# EAGLE design euglena (EAGLE 7.4.0)
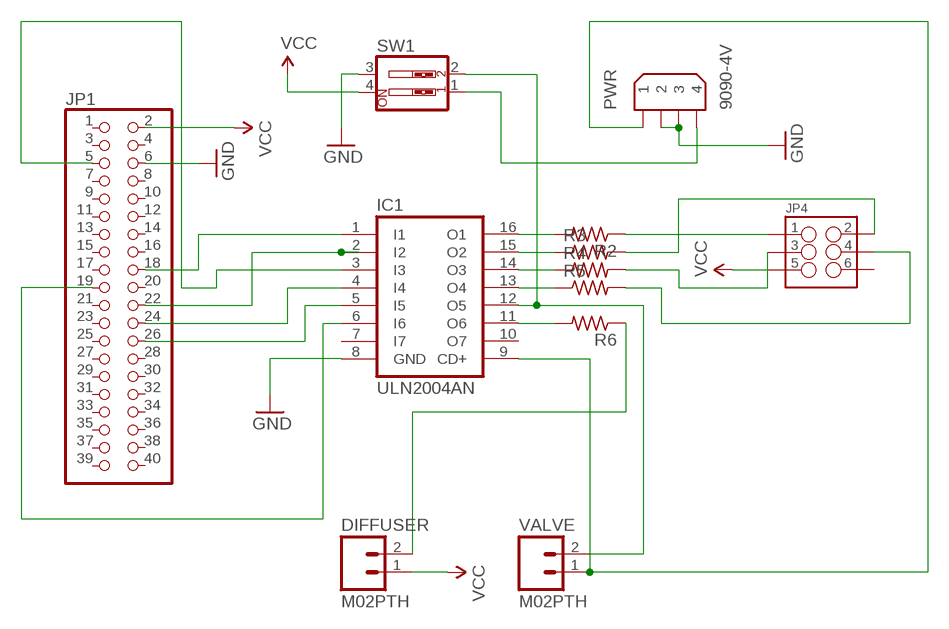
[diagram p0: schematic, sheet 1]

## Parts
DIFFUSER  M02PTH  [1X02]
IC1  ULN2004AN  [DIL16]
JP1  PINHD-2X20  [2X20]
JP4  M03X2NO_SILK  [2X3-NS]
PWR  9090-4V  [9090-4V]
R2  R-US_0204/5  [0204/5]
R3  R-US_0204/5  [0204/5]
R4  R-US_0204/5  [0204/5]
R5  R-US_0204/5  [0204/5]
R6  R-US_0204/5  [0204/5]
SW1  SW_DIP-2  [DIPSWITCH-02]
VALVE  M02PTH  [1X02]

## Nets
5V: PWR.4 SW1.1
12V: IC1.9(CD+) PWR.1 VALVE.1
GND: IC1.8(GND) JP1.6 PWR.2 PWR.3 SW1.3
N$1: IC1.16(O1) R2.2
N$2: IC1.2(I2) JP1.22
N$3: IC1.15(O2) R3.1
N$4: IC1.14(O3) R4.1
N$5: IC1.13(O4) R5.1
N$6: JP4.4 R5.2
N$8: JP4.1 R2.1
N$9: JP4.2 R3.2
N$10: JP4.3 R4.2
N$13: IC1.11(O6) R6.2
N$14: IC1.4(I4) JP1.24
N$18: IC1.1(I1) JP1.18
N$19: IC1.5(I5) JP1.26
N$20: IC1.3(I3) JP1.5
N$21: DIFFUSER.2 R6.1
N$22: IC1.12(O5) SW1.2 VALVE.2
N$23: IC1.6(I6) JP1.19
VCC: DIFFUSER.1 JP1.2 JP4.5 SW1.4
Unconnected: IC1.7(I7) IC1.10(O7) JP1.1 JP1.3 JP1.4 JP1.7 JP1.8 JP1.9 JP1.10 JP1.11 JP1.12 JP1.13 JP1.14 JP1.15 JP1.16 JP1.17 JP1.20 JP1.21 JP1.23 JP1.25 JP1.27 JP1.28 JP1.29 JP1.30 JP1.31 JP1.32 JP1.33 JP1.34 JP1.35 JP1.36 JP1.37 JP1.38 JP1.39 JP1.40 JP4.6

## Library data of the parts
DIFFUSER VALVE = SparkFun-Connectors:M02: Standard 2-pin 0.1" header. Use with - straight break away headers ( PRT-00116) - right angle break away headers (PRT-00553) - swiss pins (PRT-00743) - machine pins (PRT-00117) - female headers (PRT-00115) Molex polarized connector foot print use with: PRT-08233 with associated crimp pins and housings. 2.54_SCREWTERM for use with PRT-10571. 3.5mm Screw Terminal footprints for PRT-08084 5mm Screw Terminal footprints for use with PRT-08433
IC1 = uln-udn:ULN2004A: DRIVER ARRAY
JP1 = pinhead:PINHD-2X20: PIN HEADER
JP4 = SparkFun-Connectors:M03X2: 2x3 .1" header. Shrouded, with keying- CONN-10681 SMT- CONN-11415 Pogo pins- HW-11044
PWR = con-thomas-betts:9090-4: Disk Drive Power four position Source: Thomas & Betts Electronic Interconnects Eiropean Edition 1998; OC_FARNELL: unknown; OC_NEWARK: unknown
R2-R6 = resistor:R-US_: RESISTOR, American symbol
SW1 = SparkFun-Electromechanical:SW_DIP-2: DIP SWITCH

## Net classes
0 default: clearance 0.205 mm

## Board
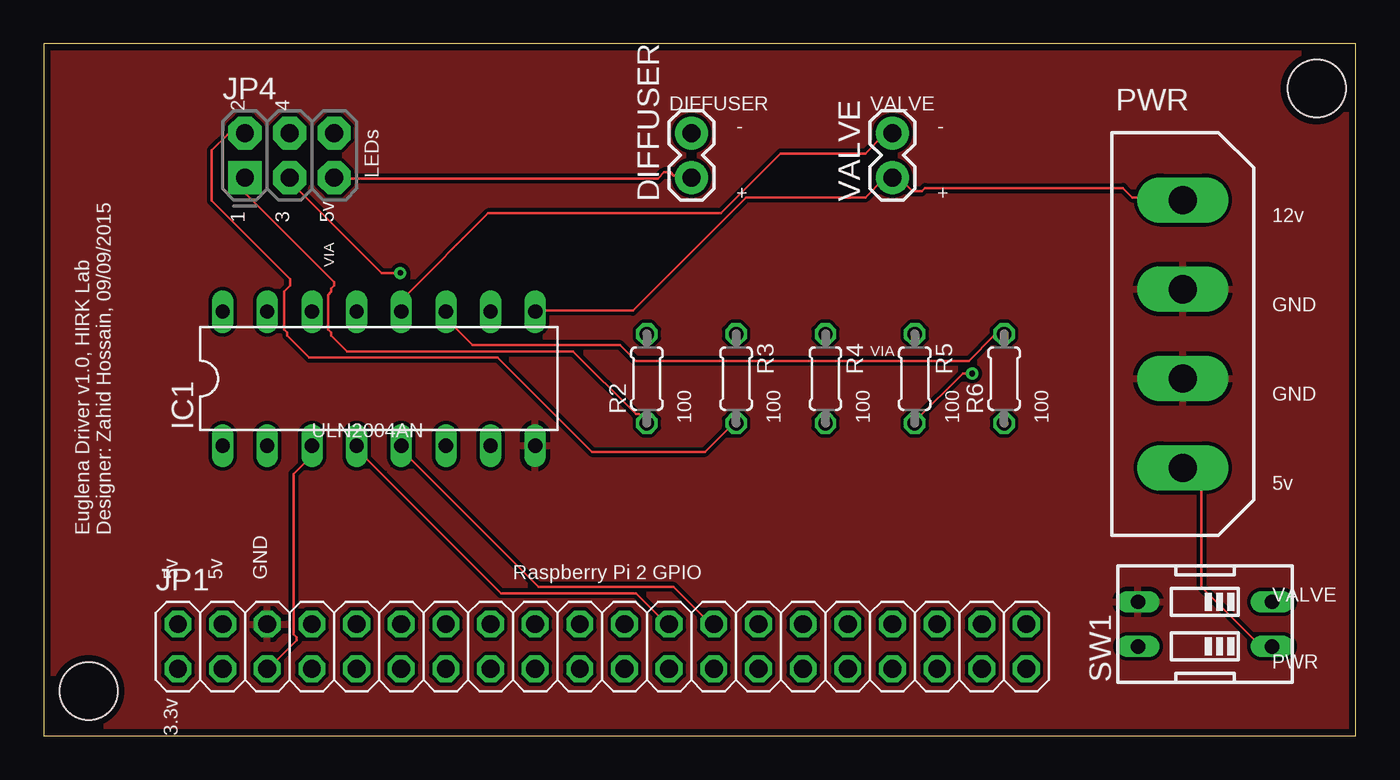
[diagram p1: board, top side]
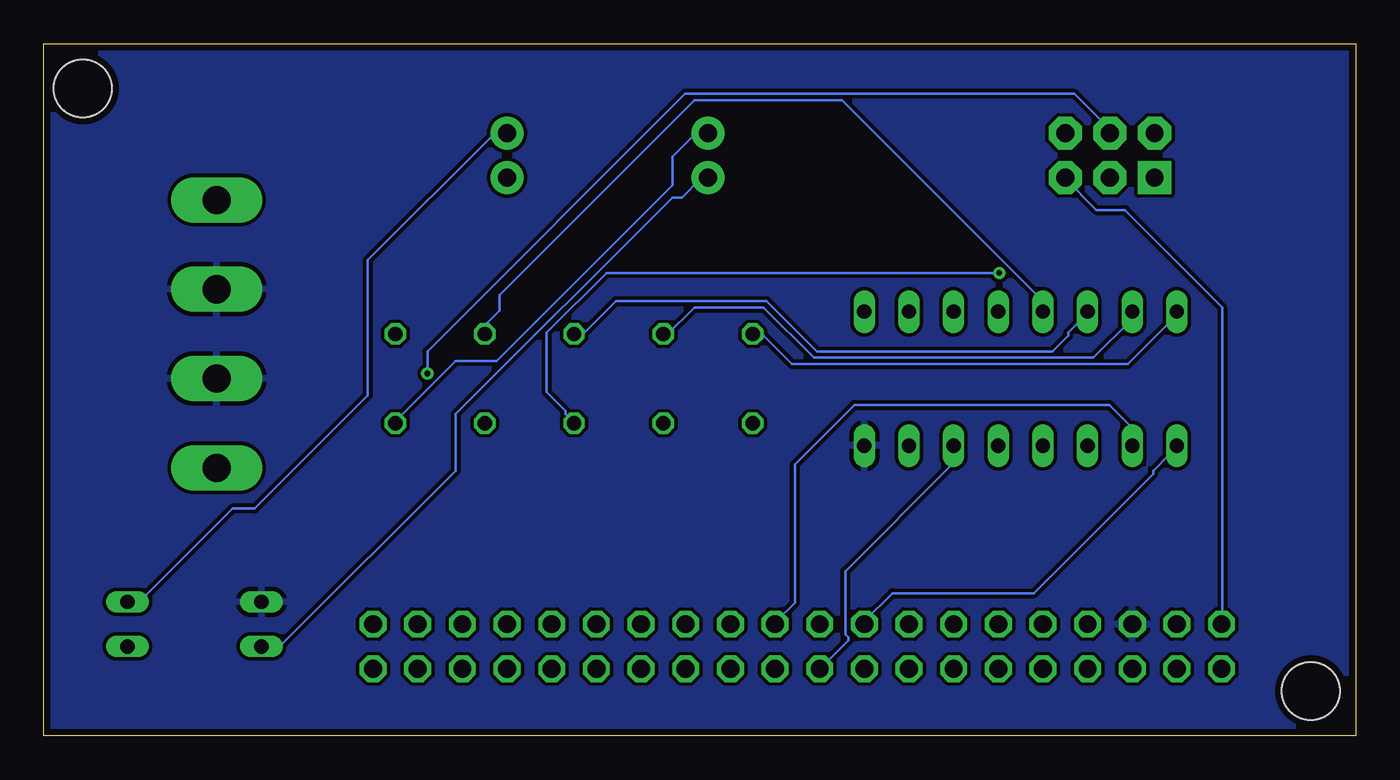
[diagram p2: board, bottom side, seen from below]

Size 74.6 x 39.36 mm. Coordinates in mm from the lower left corner, seen from the top.
Outline: 0,0 74.6,0 74.6,39.36 0,39.36 0,0
Copper layers (1*16): Top 0.0356mm / dielectric 1.5011mm / Bottom 0.0356mm
Design rules "LaenPCBOrder": minimum track width 6mil, minimum drill 13mil, track to track 6mil, track to pad 6mil, pad to pad 6mil, via to via 6mil, smd to smd 6mil, copper to edge 15mil, drill to drill 6mil, minimum pad ring 7mil, minimum via ring 7mil, stop-mask expansion 3mil, vias tented up to drill 0mil, thermal gap 10mil

### Footprints (pad centres in the part's own frame; a part is rotated, then mirrored left to right if it is on the bottom)
1X02 = drill 1.016 pad 1.88: 1 0,0; 2 2.54,0
STAND-OFF = hole 3.302: 0,0
DIL16 = drill 0.813 long: 1 -8.89,-3.81; 2 -6.35,-3.81; 3 -3.81,-3.81; 4 -1.27,-3.81; 5 1.27,-3.81; 6 3.81,-3.81; 7 6.35,-3.81; 8 8.89,-3.81; 9 8.89,3.81; 10 6.35,3.81; 11 3.81,3.81; 12 1.27,3.81; 13 -1.27,3.81; 14 -3.81,3.81; 15 -6.35,3.81; 16 -8.89,3.81
2X20 = drill 1.016 octagon: 1 -24.13,-1.27; 2 -24.13,1.27; 3 -21.59,-1.27; 4 -21.59,1.27; 5 -19.05,-1.27; 6 -19.05,1.27; 7 -16.51,-1.27; 8 -16.51,1.27; 9 -13.97,-1.27; 10 -13.97,1.27; 11 -11.43,-1.27; 12 -11.43,1.27; 13 -8.89,-1.27; 14 -8.89,1.27; 15 -6.35,-1.27; 16 -6.35,1.27; 17 -3.81,-1.27; 18 -3.81,1.27; 19 -1.27,-1.27; 20 -1.27,1.27; 21 1.27,-1.27; 22 1.27,1.27; 23 3.81,-1.27; 24 3.81,1.27; 25 6.35,-1.27; 26 6.35,1.27; 27 8.89,-1.27; 28 8.89,1.27; 29 11.43,-1.27; 30 11.43,1.27; 31 13.97,-1.27; 32 13.97,1.27; 33 16.51,-1.27; 34 16.51,1.27; 35 19.05,-1.27; 36 19.05,1.27; 37 21.59,-1.27; 38 21.59,1.27; 39 24.13,-1.27; 40 24.13,1.27
2X3-NS = drill 1.016 pad 1.88 square: 1 -2.54,-1.27 | drill 1.016 pad 1.88 octagon: 2 -2.54,1.27; 3 0,-1.27; 4 0,1.27; 5 2.54,-1.27; 6 2.54,1.27
9090-4V = drill 1.6 pad 2.6 long: 1 -7.62,0; 2 -2.54,0; 3 2.54,0; 4 7.62,0
0204/5 = drill 0.813 octagon: 1 -2.54,0; 2 2.54,0
DIPSWITCH-02 = drill 0.813 long: 1 -1.27,-3.81; 2 1.27,-3.81; 3 1.27,3.81; 4 -1.27,3.81

### Placement (x,y rotation side)
DIFFUSER  36.83,31.75 90 top
E$1  [STAND-OFF]  72.39,36.83 0 top
E$2  [STAND-OFF]  2.54,2.54 0 top
IC1  19.05,20.32 0 top
JP1  31.75,5.08 0 top
JP4  13.97,33.02 0 top
PWR  64.77,22.86 270 top
R2  34.29,20.32 90 top
R3  39.37,20.32 270 top
R4  44.45,20.32 270 top
R5  49.53,20.32 270 top
R6  54.61,20.32 90 top
SW1  66.04,6.35 90 top
VALVE  48.26,31.75 90 top

### Tracks (layer width: path | path; a pad name or v marks a point on that pad's centre or on a via)
5V
  Top 0.152: SW1.1 69.77,5.25 69.06,5.25 65.84,8.46 65.84,14.18 64.94,15.08 PWR.4
12V
  Top 0.152: IC1.9 27.95,24.19 33.49,24.19 39.93,30.62 46.72,30.62 47.79,31.7 48.15,31.7 VALVE.1 48.32,31.7 48.68,31.7 49.4,30.98 49.93,30.98 50.11,31.16 61.37,31.16 61.91,30.62 64.77,30.62 PWR.1
GND
  pour Top: 0,39.37 0,0 74.93,0 74.93,39.37
  pour Bottom: -1.27,40.64 -1.27,-1.27 76.2,-1.27 76.2,40.64
N$1
  Bottom 0.152: IC1.16 10.26,24.01 10.62,23.65 10.62,23.48 12.94,21.15 32.06,21.15 33.67,22.76 34.21,22.76 R2.2
N$2
  Bottom 0.152: IC1.2 12.76,16.68 12.76,17.58 14.02,18.83 28.49,18.83 31.88,15.43 31.88,7.57 32.96,6.5 JP1.22
N$3
  Bottom 0.152: IC1.15 12.76,24.01 12.76,23.65 14.91,21.51 30.81,21.51 33.67,24.37 37.6,24.37 39.21,22.76 R3.1
N$4
  Bottom 0.152: IC1.14 15.27,24.01 16.34,22.94 16.34,22.76 17.23,21.87 30.63,21.87 33.49,24.73 42.07,24.73 43.86,22.94 44.39,22.94 R4.1
N$5
  Bottom 0.152: IC1.13 17.95,24.19 17.95,24.9 29.2,36.16 37.6,36.16 48.68,25.08 48.68,24.19 49.4,23.48 49.4,22.94 R5.1
N$6  (via drill 0.33)
  Top 0.152: v52.79,20.62 52.26,20.62 49.58,17.94 R5.2
  Bottom 0.152: v52.79,20.62 52.79,21.87 38.14,36.52 15.98,36.52 13.84,34.38 JP4.4
N$8
  Top 0.152: R2.1 34.21,17.94 33.85,18.29 33.67,18.29 30.1,21.87 17.23,21.87 16.34,22.76 16.34,22.94 16.16,23.12 16.16,25.08 16.34,25.26 16.34,25.44 16.52,25.62 16.52,25.8 11.51,30.8 11.51,31.7 JP4.1
N$9
  Top 0.152: R3.2 39.21,17.76 37.6,16.15 31.17,16.15 25.81,21.51 15.09,21.51 13.84,22.76 13.84,22.94 13.66,23.12 13.66,25.26 14.02,25.62 14.02,25.98 9.55,30.44 9.55,33.3 10.44,34.2 11.34,34.2 JP4.2
N$10  (via drill 0.33)
  Top 0.152: v20.27,26.33 19.2,26.33 13.84,31.7 JP4.3
  Bottom 0.152: v20.27,26.33 42.61,26.33 46,22.94 46,19.54 44.93,18.47 44.93,18.29 44.57,17.94 R4.2
N$13
  Top 0.152: IC1.11 22.95,24.01 22.95,23.65 24.38,22.22 32.78,22.22 33.67,21.33 52.61,21.33 54.04,22.76 54.58,22.76 R6.2
N$14
  Top 0.152: IC1.4 17.95,16.51 17.95,16.15 25.99,8.11 33.67,8.11 35.46,6.32 JP1.24
N$18
  Bottom 0.152: IC1.1 10.26,16.51 10.62,16.15 10.62,15.97 11.51,15.08 11.51,14.9 18.3,8.11 26.34,8.11 27.95,6.5 JP1.18
N$19
  Top 0.152: IC1.5 20.45,16.51 20.45,16.15 28.13,8.46 35.82,8.46 37.96,6.32 JP1.26
N$20
  Top 0.152: IC1.3 15.09,16.51 15.09,15.79 14.19,14.9 14.19,5.78 14.37,5.6 14.37,5.43 12.76,3.82 JP1.5
N$21
  Bottom 0.152: R6.1 54.58,17.94 51.18,21.33 48.86,21.33 38.85,31.34 38.85,32.95 37.6,34.2 36.89,34.2 DIFFUSER.2
N$22
  Top 0.152: IC1.12 20.45,24.19 20.45,24.9 25.27,29.73 38.5,29.73 41.89,33.13 46.72,33.13 47.79,34.2 48.15,34.2 VALVE.2
  Bottom 0.152: SW1.2 69.77,7.75 69.06,7.75 63.87,12.93 62.62,12.93 56.19,19.37 56.19,27.05 49.04,34.2 48.32,34.2 VALVE.2
N$23
  Bottom 0.152: IC1.6 22.95,16.51 22.95,15.43 29.03,9.36 29.03,5.78 28.85,5.6 28.85,5.43 30.45,3.82 JP1.19
VCC
  Top 0.152: JP4.5 16.52,31.7 34.92,31.7 35.28,32.05 35.64,32.05 35.82,31.87 36.71,31.87 DIFFUSER.1
  Bottom 0.152: JP1.2 7.58,6.5 7.58,24.37 13.12,29.91 14.73,29.91 16.52,31.7 JP4.5 | SW1.4 62.09,5.25 61.01,5.25 51.18,15.08 51.18,18.29 38.85,30.62 38.32,30.62 37.25,31.7 36.89,31.7 DIFFUSER.1

### Text on the board
tPlace: 2 | 4 | DIFFUSER | VALVE | - | - | LEDs | + | + | 1 | 3 | 5v | 12v | VIA | GND | VIA | GND | ULN2004AN | 100 | 100 | 100 | 100 | 100 | 5v | Euglena Driver v1.0, HIRK Lab / Designer: Zahid Hossain, 09/09/2015 | 5v | 5v | GND | Raspberry Pi 2 GPIO | VALVE | PWR | 3.3v